# Altium project top_g.PrjPcb
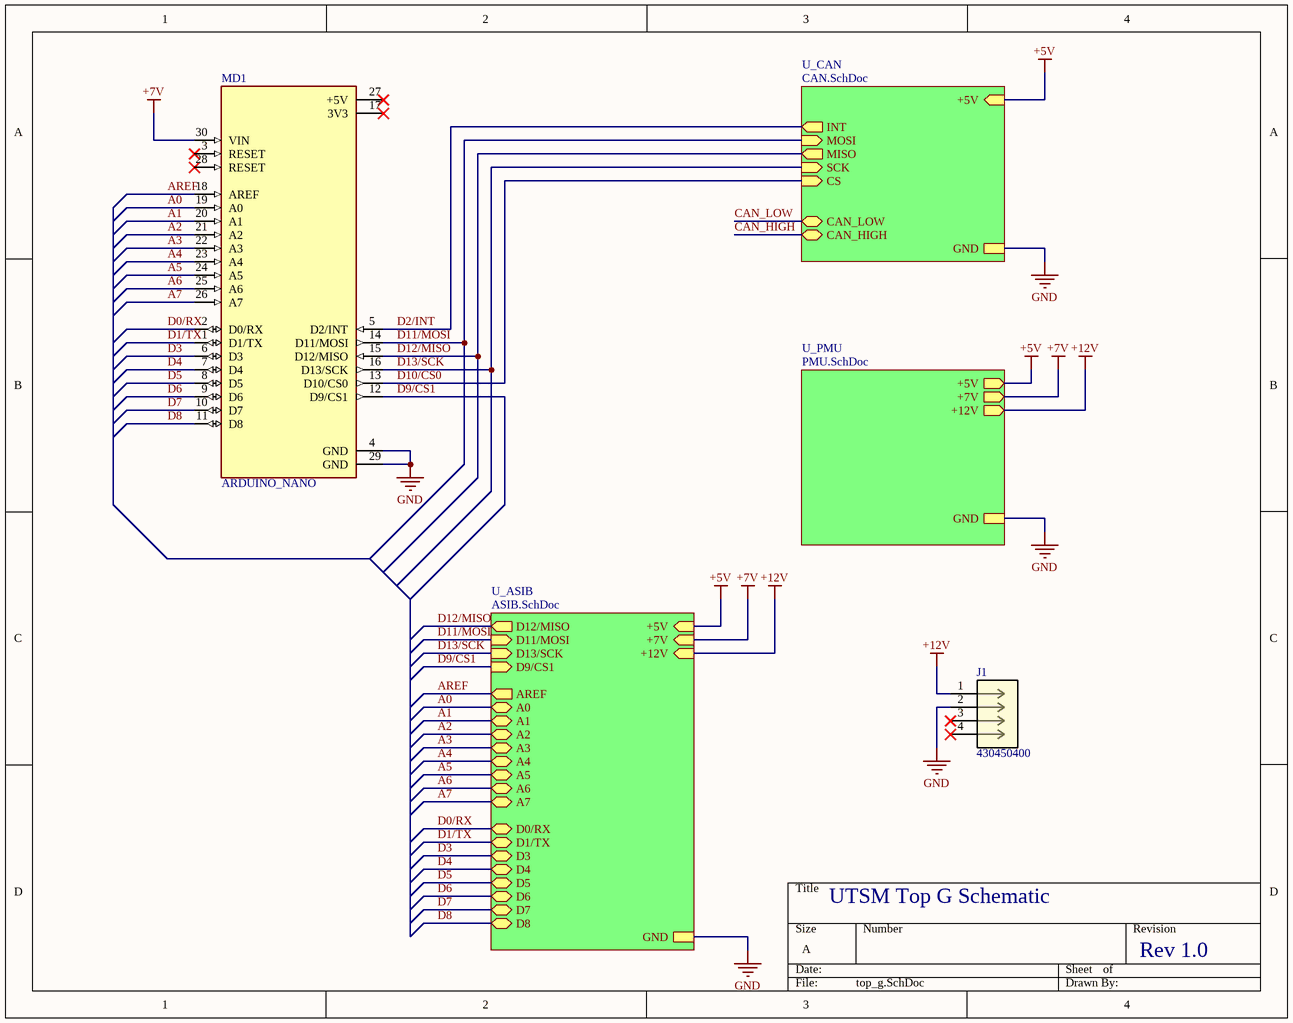
[diagram p0: top_g.SchDoc]
3 sheets, 6 parts. Net scope: hierarchical (ports join the sheet entries above them; power ports are global).
Board file: top_g.PcbDoc
Sheets:
  top_g.SchDoc
    U_ASIB = ASIB.SchDoc
    U_PMU = PMU.SchDoc

## Sheet top_g.SchDoc
size A; SheetNumber: 1; SheetTotal: 4

### Parts
J1  430450400  [CON_430450400_MOL]
MD1  ARDUINO_NANO  [SHIELD_ARDUINO_NANO]

### Sub-sheets
U_ASIB = ASIB.SchDoc: A0 (bidir), A1 (bidir), A2 (bidir), A3 (bidir), A4 (bidir), A5 (bidir), A6 (bidir), A7 (bidir), AREF (out), D0/RX (bidir), D1/TX (bidir), D3 (bidir), D4 (bidir), D5 (bidir), D6 (bidir), D7 (bidir), D8 (bidir), D9/CS1 (in), D11/MOSI (in), D12/MISO (out), D13/SCK (in), +5V (in), +7V (in), +12V (in), GND
U_CAN = CAN.SchDoc (file not in this document): CAN_HIGH (bidir), CAN_LOW (bidir), +5V (in), GND, MISO (out), MOSI (in), SCK (in), CS (in), INT (out)
U_PMU = PMU.SchDoc: +5V (out), +7V (out), +12V (out), GND

### Nets
+5V: sheet U_ASIB/+5V, sheet U_CAN/+5V, sheet U_PMU/+5V
+7V: MD1.30(VIN) ; sheet U_ASIB/+7V, sheet U_PMU/+7V
+12V: J1.1 ; sheet U_ASIB/+12V, sheet U_PMU/+12V
GND: J1.2 MD1.4(GND) MD1.29(GND) ; sheet U_ASIB/GND, sheet U_CAN/GND, sheet U_PMU/GND
A0: MD1.19(A0) ; sheet U_ASIB/A0
A1: MD1.20(A1) ; sheet U_ASIB/A1
A2: MD1.21(A2) ; sheet U_ASIB/A2
A3: MD1.22(A3) ; sheet U_ASIB/A3
A4: MD1.23(A4) ; sheet U_ASIB/A4
A5: MD1.24(A5) ; sheet U_ASIB/A5
A6: MD1.25(A6) ; sheet U_ASIB/A6
A7: MD1.26(A7) ; sheet U_ASIB/A7
AREF: MD1.18(AREF) ; sheet U_ASIB/AREF
CAN_HIGH: sheet U_CAN/CAN_HIGH
CAN_LOW: sheet U_CAN/CAN_LOW
D0/RX: MD1.2(D0/RX) ; sheet U_ASIB/D0/RX
D1/TX: MD1.1(D1/TX) ; sheet U_ASIB/D1/TX
D2/INT: MD1.5(D2/INT) ; sheet U_CAN/INT
D3: MD1.6(D3) ; sheet U_ASIB/D3
D4: MD1.7(D4) ; sheet U_ASIB/D4
D5: MD1.8(D5) ; sheet U_ASIB/D5
D6: MD1.9(D6) ; sheet U_ASIB/D6
D7: MD1.10(D7) ; sheet U_ASIB/D7
D8: MD1.11(D8) ; sheet U_ASIB/D8
D9/CS1: MD1.12(D9/CS1) ; sheet U_ASIB/D9/CS1
D10/CS0: MD1.13(D10/CS0) ; sheet U_CAN/CS
D11/MOSI: MD1.14(D11/MOSI) ; sheet U_ASIB/D11/MOSI, sheet U_CAN/MOSI
D12/MISO: MD1.15(D12/MISO) ; sheet U_ASIB/D12/MISO, sheet U_CAN/MISO
D13/SCK: MD1.16(D13/SCK) ; sheet U_ASIB/D13/SCK, sheet U_CAN/SCK

Not connected (* = marked no-connect by the designer): J1 3* 4*; MD1 3(RESET)* 17(3V3)* 27(+5V)* 28(RESET)*

### Notes on the sheet
- UTSM Top G Schematic
- Rev 1.0

### Library data of the parts
J1 = 430450400: +12 from Battery; Mfr_Name: Molex Connector Corporation; RefDes: RefDes; Type: Type
MD1 = ARDUINO_NANO: Small, complete, and breadboard-friendly board based on the ATmega328 (Arduino Nano 3.x); Check_prices: https://www.snapeda.com/parts/Arduino%20Nano/Arduino/view-part/?ref=eda; Value: *; Availability: Not in stock; MP: Arduino Nano; Price: None; Package: Non-Standard Arduino; SnapEDA_Link: https://www.snapeda.com/parts/Arduino%20Nano/Arduino/view-part/?ref=snap; MF: Arduino

## Sheet ASIB.SchDoc
size A; SheetNumber: 2; SheetTotal: 4
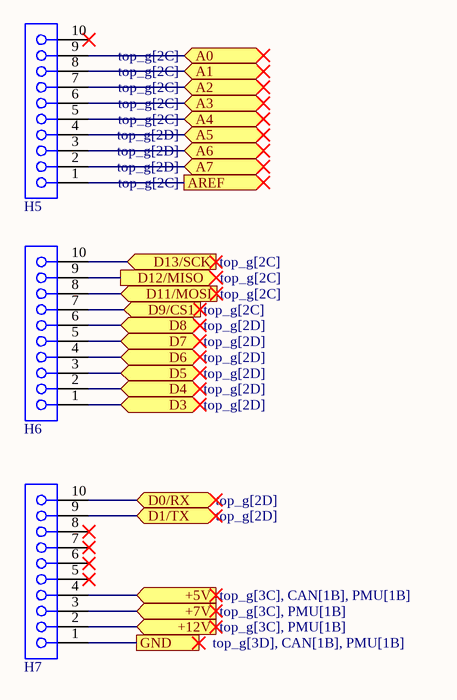
[diagram p1: ASIB.SchDoc]

### Parts
H5  61301011821  [61301011821]  (value not drawn)
H6  61301011821  [61301011821]  (value not drawn)
H7  61301011821  [61301011821]  (value not drawn)

### Ports
+5V (in, see top_g[3C], CAN[1B], PMU[1B]), +7V (in, see top_g[3C], PMU[1B]), +12V (in, see top_g[3C], PMU[1B]), A0 (bidir, see top_g[2C]), A1 (bidir, see top_g[2C]), A2 (bidir, see top_g[2C]), A3 (bidir, see top_g[2C]), A4 (bidir, see top_g[2C]), A5 (bidir, see top_g[2D]), A6 (bidir, see top_g[2D]), A7 (bidir, see top_g[2D]), AREF (out, see top_g[2C]), D0/RX (bidir, see top_g[2D]), D1/TX (bidir, see top_g[2D]), D3 (bidir, see top_g[2D]), D4 (bidir, see top_g[2D]), D5 (bidir, see top_g[2D]), D6 (bidir, see top_g[2D]), D7 (bidir, see top_g[2D]), D8 (bidir, see top_g[2D]), D9/CS1 (in, see top_g[2C]), D11/MOSI (in, see top_g[2C]), D12/MISO (out, see top_g[2C]), D13/SCK (in, see top_g[2C]), GND (see top_g[3D], CAN[1B], PMU[1B])

### Nets
+5V: H7.4 ; port +5V
+7V: H7.3 ; port +7V
+12V: H7.2 ; port +12V
GND: H7.1 ; port GND
A0: H5.9 ; port A0
A1: H5.8 ; port A1
A2: H5.7 ; port A2
A3: H5.6 ; port A3
A4: H5.5 ; port A4
A5: H5.4 ; port A5
A6: H5.3 ; port A6
A7: H5.2 ; port A7
AREF: H5.1 ; port AREF
D0/RX: H7.10 ; port D0/RX
D1/TX: H7.9 ; port D1/TX
D3: H6.1 ; port D3
D4: H6.2 ; port D4
D5: H6.3 ; port D5
D6: H6.4 ; port D6
D7: H6.5 ; port D7
D8: H6.6 ; port D8
D9/CS1: H6.7 ; port D9/CS1
D11/MOSI: H6.8 ; port D11/MOSI
D12/MISO: H6.9 ; port D12/MISO
D13/SCK: H6.10 ; port D13/SCK

Not connected (* = marked no-connect by the designer): H5 10*; H7 5* 6* 7* 8*

### Library data of the parts
H5-H7 = 61301011821: WR-PHD Socket Header, THT, Vertical, pitch 2.54mm, 1 Row, 10P; Manufacturer: Wurth Elektronik; Contact Resistance: 20mOhm; Rated Current: 3A; Working Voltage: 250V; Withstanding Voltage: 500V; Manufacturer Part Number: 61301011821; Category: Board-to-Board Connectors; Match Code: WR-PHD; ComponentLink1Description: Website Link; ComponentLink1URL: https://www.we-online.com/redexpert/article/61301011821?ad; ComponentLink2Description: Datasheet Link; ComponentLink2URL: https://www.we-online.com/redexpert/spec/61301011821?ad; Mount: Through Hole; Operating Temperature Max: 105°C; Operating Temperature Min: -40°C; Packaging: Tray; Gender: Socket Header; Number of Pins: 10; Number of Rows: 1; Orientation: Vertical; Pitch: 2.54mm

## Sheet PMU.SchDoc
size A; SheetNumber: 4; SheetTotal: 4
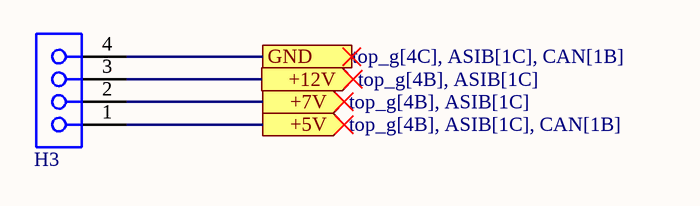
[diagram p2: PMU.SchDoc]

### Parts
H3  61300411821  [61300411821]  (value not drawn)

### Ports
+5V (out, see top_g[4B], ASIB[1C], CAN[1B]), +7V (out, see top_g[4B], ASIB[1C]), +12V (out, see top_g[4B], ASIB[1C]), GND (see top_g[4C], ASIB[1C], CAN[1B])

### Nets
+5V: H3.1 ; port +5V
+7V: H3.2 ; port +7V
+12V: H3.3 ; port +12V
GND: H3.4 ; port GND

### Library data of the parts
H3 = 61300411821: WR-PHD Socket Header, THT, Vertical, pitch 2.54mm, 1 Row, 4P; Manufacturer: Wurth Elektronik; Contact Resistance: 20mOhm; Rated Current: 3A; Working Voltage: 250V; Withstanding Voltage: 500V; Manufacturer Part Number: 61300411821; Category: Board-to-Board Connectors; Match Code: WR-PHD; ComponentLink1Description: Website Link; ComponentLink1URL: https://www.we-online.com/redexpert/article/61300411821?ad; ComponentLink2Description: Datasheet Link; ComponentLink2URL: https://www.we-online.com/redexpert/spec/61300411821?ad; Mount: Through Hole; Operating Temperature Max: 125°C; Operating Temperature Min: -40°C; Packaging: Tray; Gender: Socket Header; Number of Pins: 4; Number of Rows: 1; Orientation: Vertical; Pitch: 2.54mm

## Nets that join several sheets
+5V: ASIB (H7.4), PMU (H3.1)
+7V: top_g (MD1.30), ASIB (H7.3), PMU (H3.2)
+12V: top_g (J1.1), ASIB (H7.2), PMU (H3.3)
GND: top_g (J1.2 MD1.4 MD1.29), ASIB (H7.1), PMU (H3.4)
A0: top_g (MD1.19), ASIB (H5.9)
A1: top_g (MD1.20), ASIB (H5.8)
A2: top_g (MD1.21), ASIB (H5.7)
A3: top_g (MD1.22), ASIB (H5.6)
A4: top_g (MD1.23), ASIB (H5.5)
A5: top_g (MD1.24), ASIB (H5.4)
A6: top_g (MD1.25), ASIB (H5.3)
A7: top_g (MD1.26), ASIB (H5.2)
AREF: top_g (MD1.18), ASIB (H5.1)
D0/RX: top_g (MD1.2), ASIB (H7.10)
D1/TX: top_g (MD1.1), ASIB (H7.9)
D3: top_g (MD1.6), ASIB (H6.1)
D4: top_g (MD1.7), ASIB (H6.2)
D5: top_g (MD1.8), ASIB (H6.3)
D6: top_g (MD1.9), ASIB (H6.4)
D7: top_g (MD1.10), ASIB (H6.5)
D8: top_g (MD1.11), ASIB (H6.6)
D9/CS1: top_g (MD1.12), ASIB (H6.7)
D11/MOSI: top_g (MD1.14), ASIB (H6.8)
D12/MISO: top_g (MD1.15), ASIB (H6.9)
D13/SCK: top_g (MD1.16), ASIB (H6.10)